# EAGLE design M169B (EAGLE 4.11)
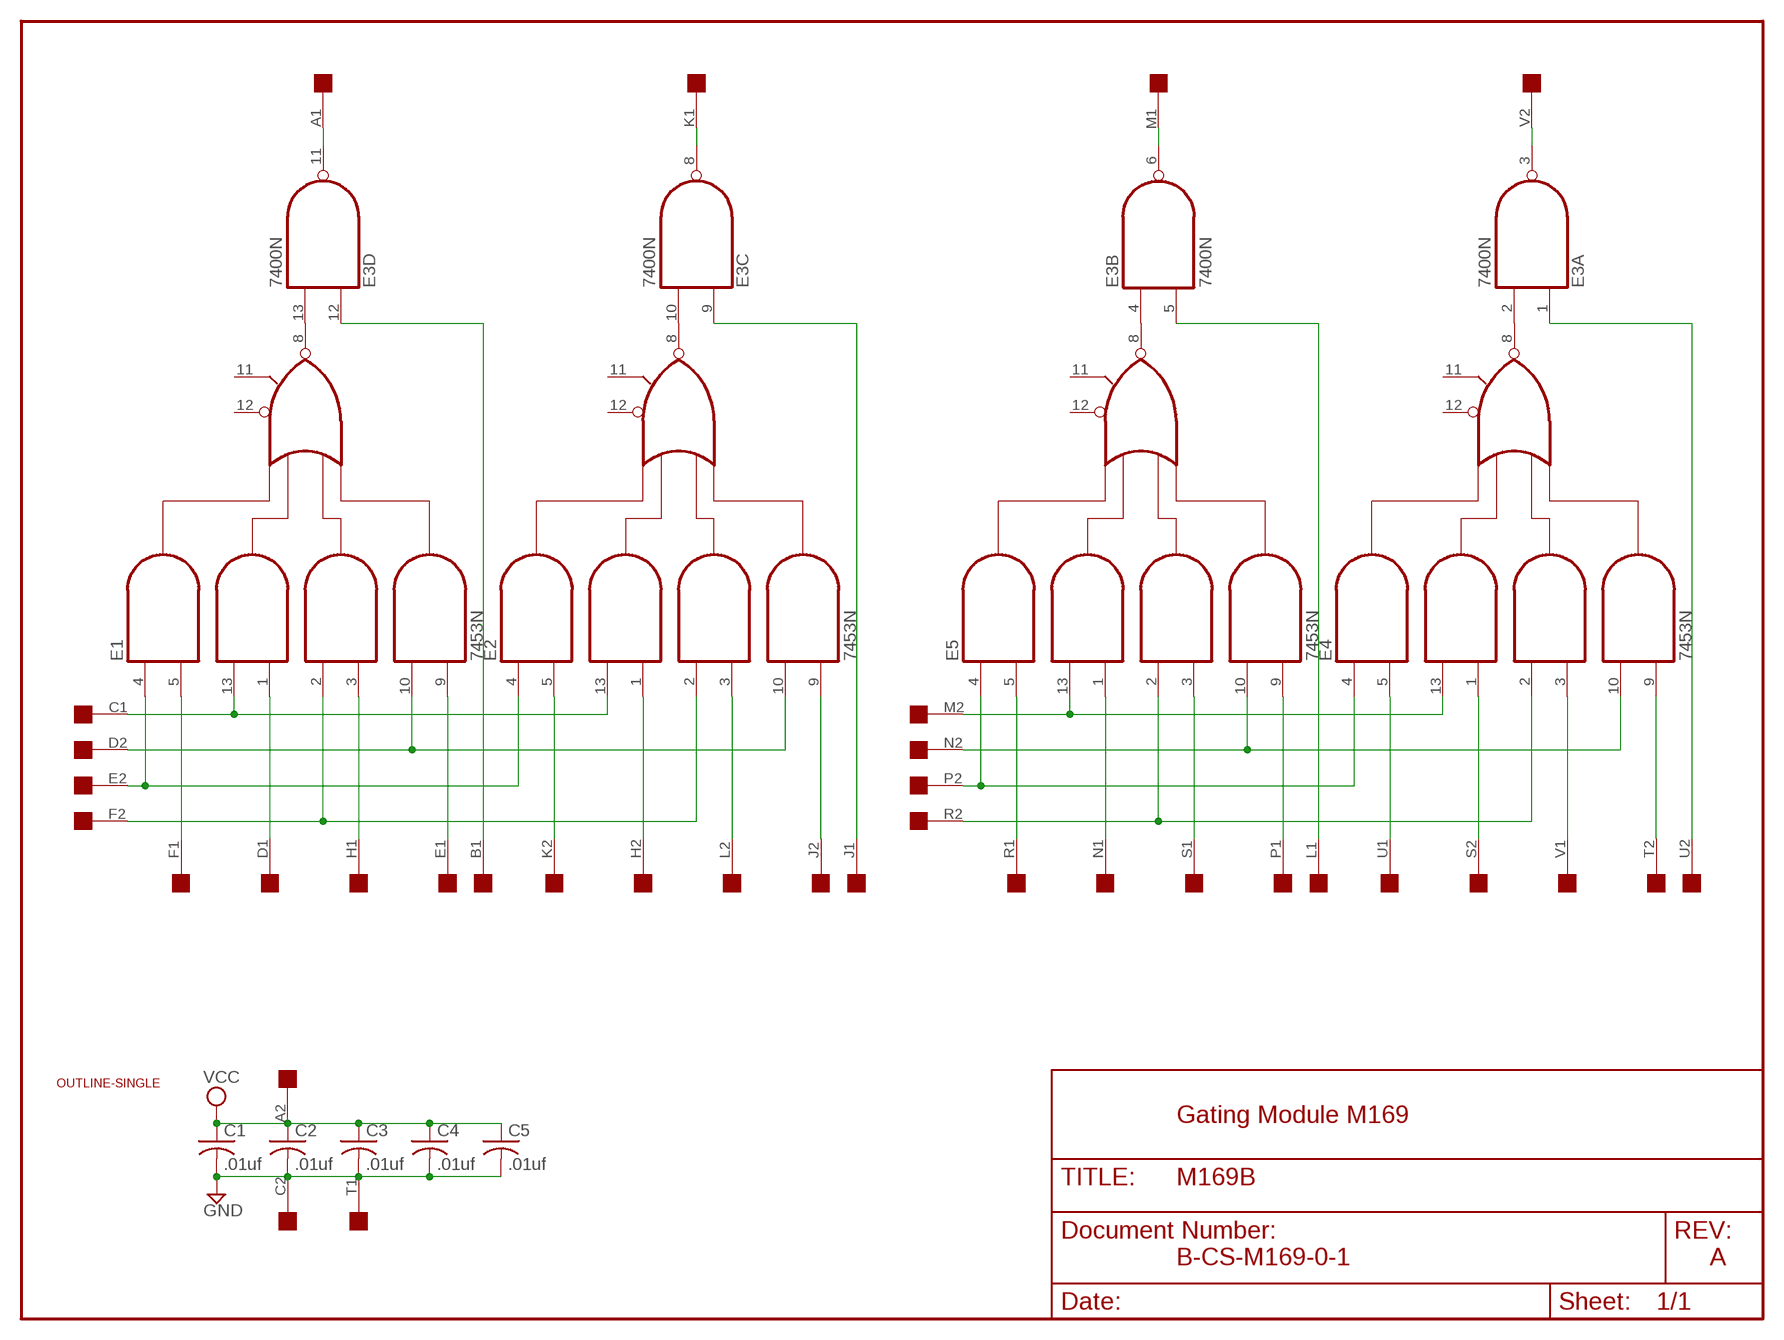
[diagram p0: schematic, sheet 1]

## Parts
C1  .01uf  C-US050-025X075  [C050-025X075]
C2  .01uf  C-US050-025X075  [C050-025X075]
C3  .01uf  C-US050-025X075  [C050-025X075]
C4  .01uf  C-US050-025X075  [C050-025X075]
C5  .01uf  C-US050-025X075  [C050-025X075]
E1  7453N  [DIL14]
E2  7453N  [DIL14]
E3  7400N  [DIL14]
E4  7453N  [DIL14]
E5  7453N  [DIL14]
U$1  OUTLINE-SINGLE  [SINGLE]
U$2  EDGE-2CONNECTOR  [EDGE-CON2]

## Nets
GND [Supply]: C1.2 C2.2 C3.2 C4.2 C5.2 U$2.C2 U$2.T1
N$1: E1.8(O) E3.13(D:I1)
N$2: E3.11(D:O) U$2.A1
N$3: E1.13(I3) E2.13(I3) U$2.C1
N$4: E1.10(I7) E2.10(I7) U$2.D2
N$5: E1.4(I1) E2.4(I1) U$2.E2
N$6: E1.2(I5) E2.2(I5) U$2.F2
N$7: E2.8(O) E3.10(C:I1)
N$8: E3.8(C:O) U$2.K1
N$9: E2.9(I8) U$2.J2
N$10: E1.5(I2) U$2.F1
N$11: E1.1(I4) U$2.D1
N$12: E1.3(I6) U$2.H1
N$13: E1.9(I8) U$2.E1
N$14: E3.12(D:I0) U$2.B1
N$15: E2.5(I2) U$2.K2
N$16: E2.1(I4) U$2.H2
N$17: E2.3(I6) U$2.L2
N$18: E4.13(I3) E5.13(I3) U$2.M2
N$19: E4.10(I7) E5.10(I7) U$2.N2
N$20: E4.4(I1) E5.4(I1) U$2.P2
N$21: E4.2(I5) E5.2(I5) U$2.R2
N$22: E3.4(B:I0) E5.8(O)
N$23: E3.2(A:I1) E4.8(O)
N$24: E3.9(C:I0) U$2.J1
N$25: E4.9(I8) U$2.T2
N$26: E5.1(I4) U$2.N1
N$27: E5.5(I2) U$2.R1
N$28: E5.3(I6) U$2.S1
N$29: E5.9(I8) U$2.P1
N$30: E3.5(B:I1) U$2.L1
N$31: E4.5(I2) U$2.U1
N$32: E4.1(I4) U$2.S2
N$33: E4.3(I6) U$2.V1
N$34: E3.1(A:I0) U$2.U2
N$35: E3.6(B:O) U$2.M1
N$36: E3.3(A:O) U$2.V2
VCC [Supply]: C1.1 C2.1 C3.1 C4.1 C5.1 U$2.A2
Unconnected: E1.11(I10) E1.12(I9) E2.11(I10) E2.12(I9) E4.11(I10) E4.12(I9) E5.11(I10) E5.12(I9) U$2.B2

## Notes on the sheet
- Gating Module M169
- B-CS-M169-0-1 | A

## Power pins joined to a net without a drawn wire
GND: E1.7(GND) E2.7(GND) E3.7(P:GND) E4.7(GND) E5.7(GND)
VCC: E1.14(VCC) E2.14(VCC) E3.14(P:VCC) E4.14(VCC) E5.14(VCC)

## Library data of the parts
C1-C5 = rcl:C-US: CAPACITOR, American symbol
E1 E2 E4 E5 = 74xxN:74*53: 4-2-3-2 input AND OR INVERTER gates
E3 = 74xx-us:74*00: Quad 2-input NAND gate
U$1 = dec-con:OUTLINE-*: Board outlines for DEC boards.
U$2 = dec-con:EDGE-2: Double-Sided DEC edge connector.

## Net classes
1 Supply: width 0.813 mm

## Board
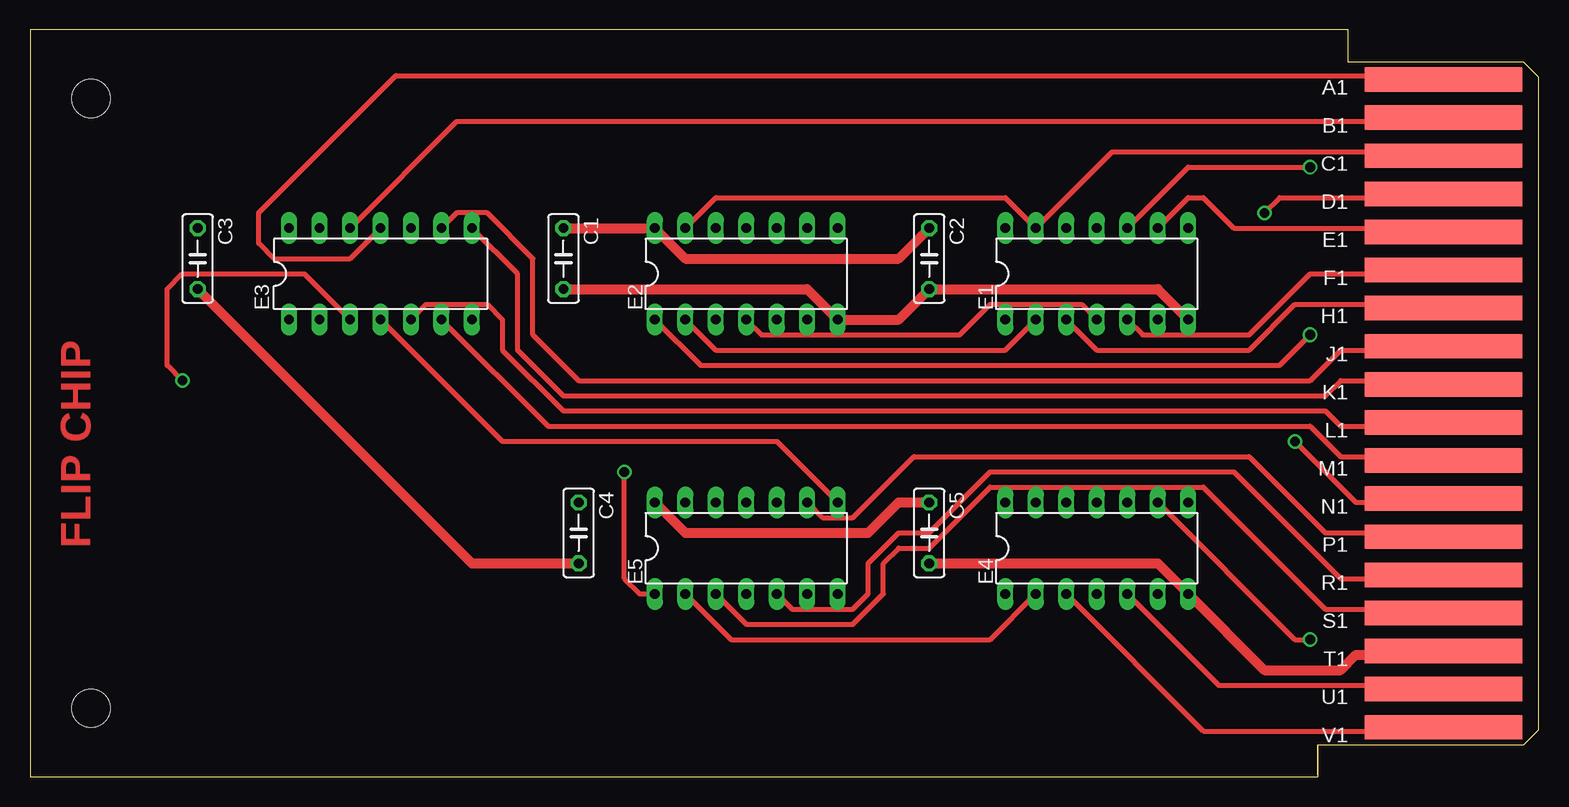
[diagram p1: board, top side]
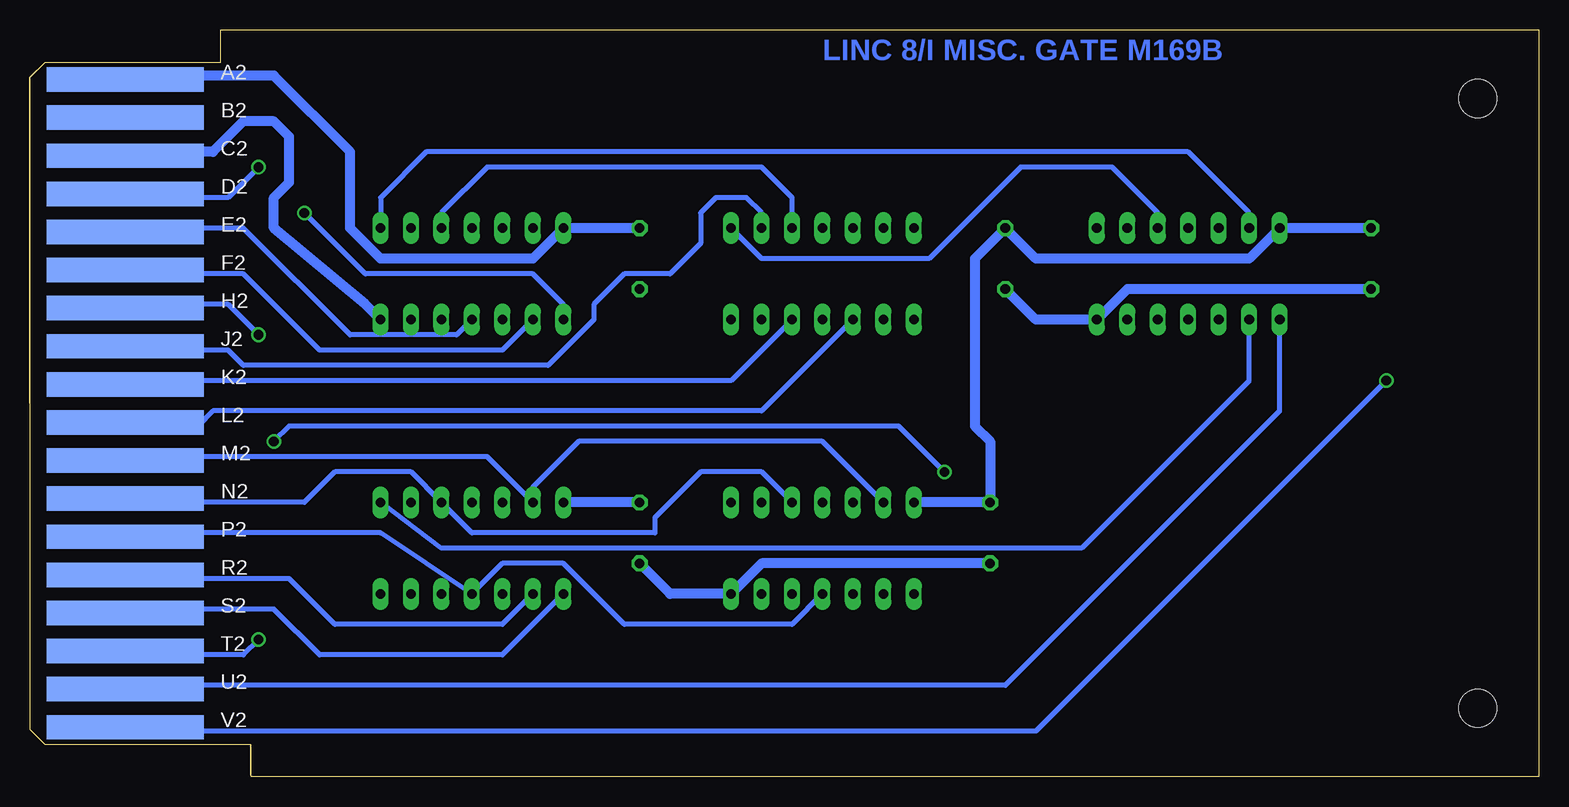
[diagram p2: board, bottom side, seen from below]

Size 125.73 x 62.23 mm. Coordinates in mm from the lower left corner, seen from the top.
Copper layers (1+16): Top 0.035mm / dielectric 1.5mm / Bottom 0.035mm
Design rules "16mils": minimum track width 16mil, minimum drill 32mil, track to track 15mil, track to pad 10mil, pad to pad 10mil, via to via 10mil, smd to smd 10mil, copper to edge 13mil, drill to drill 10mil, minimum pad ring 10mil, minimum via ring 8mil, stop-mask expansion 0mil, vias tented up to drill 0mil, thermal gap 10mil

### Footprints (pad centres in the part's own frame; a part is rotated, then mirrored left to right if it is on the bottom)
C050-025X075 = drill 0.813 octagon: 1 -2.54,0; 2 2.54,0
DIL14 = drill 0.813 long: 1 -7.62,-3.81; 2 -5.08,-3.81; 3 -2.54,-3.81; 4 0,-3.81; 5 2.54,-3.81; 6 5.08,-3.81; 7 7.62,-3.81; 8 7.62,3.81; 9 5.08,3.81; 10 2.54,3.81; 11 0,3.81; 12 -2.54,3.81; 13 -5.08,3.81; 14 -7.62,3.81
SINGLE = hole 3.175: 120.65,56.515; 120.65,5.715
EDGE-CON2 = smd 13.106 x 2.032: A1 7.938,4.128; B1 7.938,7.303; C1 7.938,10.477; D1 7.938,13.652; E1 7.938,16.828; F1 7.938,20.003; H1 7.938,23.177; J1 7.938,26.352; K1 7.938,29.527; L1 7.938,32.703; M1 7.938,35.877; N1 7.938,39.053; P1 7.938,42.227; R1 7.938,45.403; S1 7.938,48.578; T1 7.938,51.752; U1 7.938,54.928; V1 7.938,58.102 | smd 13.106 x 2.032 bottom: A2 7.938,4.128; B2 7.938,7.303; C2 7.938,10.477; D2 7.938,13.652; E2 7.938,16.828; F2 7.938,20.003; H2 7.938,23.177; J2 7.938,26.352; K2 7.938,29.527; L2 7.938,32.703; M2 7.938,35.877; N2 7.938,39.053; P2 7.938,42.227; R2 7.938,45.403; S2 7.938,48.578; T2 7.938,51.752; U2 7.938,54.928; V2 7.938,58.102

### Placement (x,y rotation side)
C1  44.45,43.18 270 top
C2  74.93,43.18 270 top
C3  13.97,43.18 270 top
C4  45.72,20.32 270 top
C5  74.93,20.32 270 top
E1  88.9,41.91 0 top
E2  59.69,41.91 0 top
E3  29.21,41.91 0 top
E4  88.9,19.05 0 top
E5  59.69,19.05 0 top
U$1  125.73,62.23 180 top
U$2  125.73,62.23 180 top
U$3  [FLIPCHIP]  0,0 0 top

### Tracks (layer width: path | path; a pad name or v marks a point on that pad's centre or on a via)
GND
  Top 0.813: C5.2 93.98,17.78 E4.7 102.87,8.89 109.22,8.89 110.49,10.16 115.57,10.16 115.9,10.49 U$2.T1 | C1.2 64.77,40.64 E2.7 72.39,38.1 C2.2 93.98,40.64 E1.7 | C4.2 36.83,17.78 C3.2
  Bottom 0.813: C4.2 64.77,17.78 E5.7 72.39,15.24 C5.2 | C3.2 34.29,40.64 E3.7 41.91,38.1 C1.2 | U$2.C2 117.17,51.74 116.84,52.07 110.49,52.07 107.95,54.61 105.41,54.61 104.14,53.34 104.14,49.53 105.41,48.26 105.41,45.72 97.79,39.37 E1.7
N$1
  Bottom 0.406: E3.13 24.13,46.99 29.21,52.07 92.71,52.07 96.52,48.26 E1.8
N$2
  Top 0.406: U$2.A1 115.97,58.02 115.57,58.42 30.48,58.42 19.05,46.99 19.05,44.45 20.32,43.18 26.67,43.18 E3.11
N$3
  Top 0.406: U$2.C1 117.17,51.74 116.84,52.07 90.17,52.07 E1.13 81.28,48.26 57.15,48.26 E2.13
N$4  (via drill 0.81)
  Top 0.406: v106.68,50.8 96.52,50.8 E1.10
  Bottom 0.406: E2.10 62.23,48.26 64.77,50.8 87.63,50.8 91.44,46.99 E1.10 | U$2.D2 117.14,48.56 116.84,48.26 109.22,48.26 v106.68,50.8
N$5
  Top 0.406: E2.4 60.96,36.83 77.47,36.83 80.01,39.37 87.63,39.37 E1.4
  Bottom 0.406: E1.4 90.17,36.83 99.06,36.83 107.95,45.72 116.84,45.72 117.17,45.39 U$2.E2
N$6
  Top 0.406: E2.2 57.15,35.56 81.28,35.56 E1.2
  Bottom 0.406: E1.2 86.36,35.56 101.6,35.56 107.95,41.91 116.84,41.91 117.12,42.19 U$2.F2
N$7
  Bottom 0.406: E3.10 31.75,46.99 35.56,50.8 43.18,50.8 50.8,43.18 64.77,43.18 E2.8
N$8
  Top 0.406: U$2.K1 117.14,32.72 116.84,33.02 109.22,33.02 107.95,31.75 44.45,31.75 40.64,35.56 40.64,41.91 E3.8
N$9
  Bottom 0.406: E2.9 64.77,46.99 66.04,48.26 68.58,48.26 69.85,46.99 69.85,44.45 72.39,41.91 76.2,41.91 78.74,39.37 78.74,38.1 82.55,34.29 107.95,34.29 109.22,35.56 115.57,35.56 115.9,35.89 U$2.J2
N$10
  Top 0.406: U$2.F1 117.12,42.19 116.84,41.91 106.68,41.91 101.6,36.83 92.71,36.83 E1.5
N$11  (via drill 0.81)
  Top 0.406: U$2.D1 117.14,48.56 116.84,48.26 104.14,48.26 v102.87,46.99
  Bottom 0.406: E1.1 81.28,39.37 83.82,41.91 97.79,41.91 v102.87,46.99
N$12
  Top 0.406: U$2.H1 113.36,39.04 113.03,39.37 105.41,39.37 101.6,35.56 88.9,35.56 E1.3
N$13
  Top 0.406: E1.9 96.52,48.26 97.79,48.26 100.33,45.72 116.84,45.72 117.17,45.39 U$2.E1
N$14
  Top 0.406: U$2.B1 115.86,54.9 115.57,54.61 35.56,54.61 E3.12
N$15
  Bottom 0.406: U$2.K2 114.61,32.72 114.3,33.02 67.31,33.02 E2.5
N$16  (via drill 0.81)
  Top 0.406: v106.68,36.83 104.14,34.29 55.88,34.29 E2.1
  Bottom 0.406: U$2.H2 115.9,39.04 115.57,39.37 109.22,39.37 v106.68,36.83
N$17
  Bottom 0.406: U$2.L2 114.63,29.54 114.3,29.21 111.76,29.21 110.49,30.48 64.77,30.48 E2.3
N$18
  Bottom 0.406: U$2.M2 115.9,26.34 115.57,26.67 87.63,26.67 E4.13 83.82,24.13 80.01,27.94 59.69,27.94 E5.13
N$19
  Bottom 0.406: U$2.N2 115.9,23.19 115.57,22.86 102.87,22.86 100.33,25.4 93.98,25.4 E4.10 88.9,20.32 73.66,20.32 73.66,21.59 69.85,25.4 64.77,25.4 E5.10
N$20
  Bottom 0.406: U$2.P2 117.17,19.99 116.84,20.32 96.52,20.32 E4.4 86.36,17.78 81.28,17.78 76.2,12.7 62.23,12.7 E5.4
N$21
  Top 0.406: E4.2 80.01,11.43 58.42,11.43 E5.2
  Bottom 0.406: U$2.R2 117.17,16.84 116.84,16.51 104.14,16.51 100.33,12.7 86.36,12.7 E4.2
N$22
  Top 0.406: E5.8 62.23,27.94 39.37,27.94 E3.4
N$23
  Bottom 0.406: E4.8 91.44,19.05 38.1,19.05 24.13,33.02 E3.2
N$24
  Top 0.406: U$2.J1 114.63,35.89 114.3,35.56 109.22,35.56 106.68,33.02 45.72,33.02 41.91,36.83 41.91,43.18 38.1,46.99 35.56,46.99 E3.9
N$25  (via drill 0.81)
  Top 0.406: v106.68,11.43 105.41,11.43 E4.9
  Bottom 0.406: U$2.T2 117.17,10.49 116.84,10.16 107.95,10.16 v106.68,11.43
N$26  (via drill 0.81)
  Top 0.406: E5.1 50.8,15.24 49.53,16.51 v49.53,25.4 | U$2.N1 117.17,23.19 116.84,22.86 110.49,22.86 v105.41,27.94
  Bottom 0.406: v49.53,25.4 53.34,29.21 104.14,29.21 v105.41,27.94
N$27
  Top 0.406: U$2.R1 117.17,16.84 116.84,16.51 109.22,16.51 100.33,25.4 80.01,25.4 74.93,20.32 72.39,20.32 69.85,17.78 69.85,15.24 68.58,13.97 63.5,13.97 E5.5
N$28
  Top 0.406: U$2.S1 117.14,13.66 116.84,13.97 107.95,13.97 97.79,24.13 80.01,24.13 74.93,19.05 72.39,19.05 71.12,17.78 71.12,15.24 68.58,12.7 59.69,12.7 E5.3
N$29
  Top 0.406: U$2.P1 115.9,19.99 115.57,20.32 107.95,20.32 101.6,26.67 73.66,26.67 68.58,21.59 66.04,21.59 E5.9
N$30
  Top 0.406: U$2.L1 115.9,29.54 115.57,29.21 109.22,29.21 107.95,30.48 44.45,30.48 39.37,35.56 39.37,38.1 38.1,39.37 33.02,39.37 E3.5
N$31
  Top 0.406: U$2.U1 115.93,7.26 115.57,7.62 99.06,7.62 E4.5
N$32
  Bottom 0.406: E4.1 86.36,10.16 101.6,10.16 105.41,13.97 116.84,13.97 117.14,13.66 U$2.S2
N$33
  Top 0.406: U$2.V1 115.96,4.2 115.57,3.81 97.79,3.81 E4.3
N$34
  Bottom 0.406: U$2.U2 117.2,7.26 116.84,7.62 44.45,7.62 21.59,30.48 E3.1
N$35
  Top 0.406: U$2.M1 117.17,26.34 116.84,26.67 109.22,26.67 106.68,29.21 43.18,29.21 E3.6
N$36  (via drill 0.81)
  Top 0.406: E3.3 22.86,41.91 12.7,41.91 11.43,40.64 11.43,34.29 v12.7,33.02
  Bottom 0.406: U$2.V2 115.96,4.2 115.57,3.81 41.91,3.81 v12.7,33.02
VCC
  Top 0.813: C1.1 E2.14 54.61,43.18 72.39,43.18 C2.1 | C5.1 72.39,22.86 69.85,20.32 54.61,20.32 E5.14
  Bottom 0.813: E5.14 C4.1 45.72,27.94 46.99,29.21 46.99,43.18 C1.1 41.91,43.18 24.13,43.18 E3.14 C3.1 | C5.1 E4.14 | C2.1 E1.14 83.82,43.18 96.52,43.18 99.06,45.72 99.06,52.07 105.41,58.42 116.84,58.42 117.24,58.02 U$2.A2

### Text on the board
Bottom: LINC 8/I MISC. GATE M169B